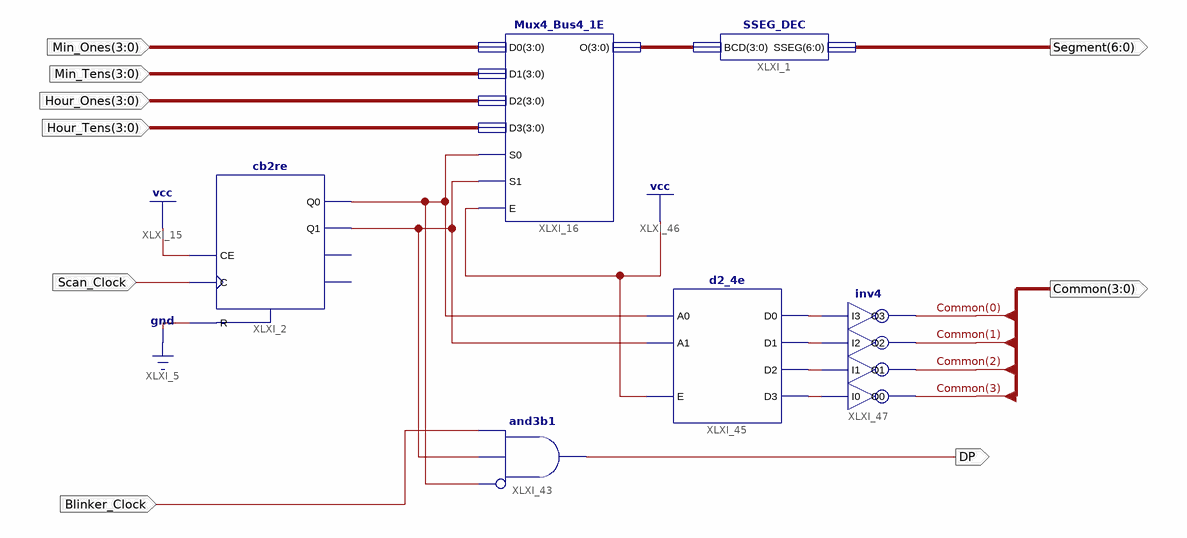
[diagram p0: schematic sheet 1]
// Xilinx ISE schematic Displayer.sch (spartan6) as structural Verilog: 6 symbols, 9 ports
module Displayer (
  input  [3:0] Hour_Tens,
  input  [3:0] Hour_Ones,
  input  [3:0] Min_Tens,
  input  [3:0] Min_Ones,
  input  Blinker_Clock,
  input  Scan_Clock,
  output [6:0] Segment,
  output DP,
  output [3:0] Common
);

  wire XLXN_70, XLXN_71, XLXN_76, XLXN_77, XLXN_78, XLXN_79;
  wire [3:0] XLXN_23;

  SSEG_DEC XLXI_1 (.BCD(XLXN_23), .SSEG(Segment));
  Mux4_Bus4_1E XLXI_16 (
    .D0(Min_Ones), .S0(XLXN_70), .S1(XLXN_71), .E(1'b1), .O(XLXN_23), .D1(Min_Tens), .D3(Hour_Tens),
    .D2(Hour_Ones));
  and XLXI_43 (DP, ~XLXN_70, XLXN_71, Blinker_Clock);  // and3b1
  d2_4e XLXI_45 (.A0(XLXN_70), .A1(XLXN_71), .E(1'b1), .D0(XLXN_79), .D1(XLXN_78), .D2(XLXN_77), .D3(XLXN_76));
  inv4 XLXI_47 (
    .I0(XLXN_76), .I1(XLXN_77), .I2(XLXN_78), .I3(XLXN_79), .O0(Common[3]), .O1(Common[2]), .O2(Common[1]),
    .O3(Common[0]));
  cb2re XLXI_2 (.C(Scan_Clock), .CE(1'b1), .R(1'b0), .Q0(XLXN_70), .Q1(XLXN_71));  // open: CEO, TC
endmodule
